# EAGLE design adns3050 v6 (EAGLE 6.6.0)
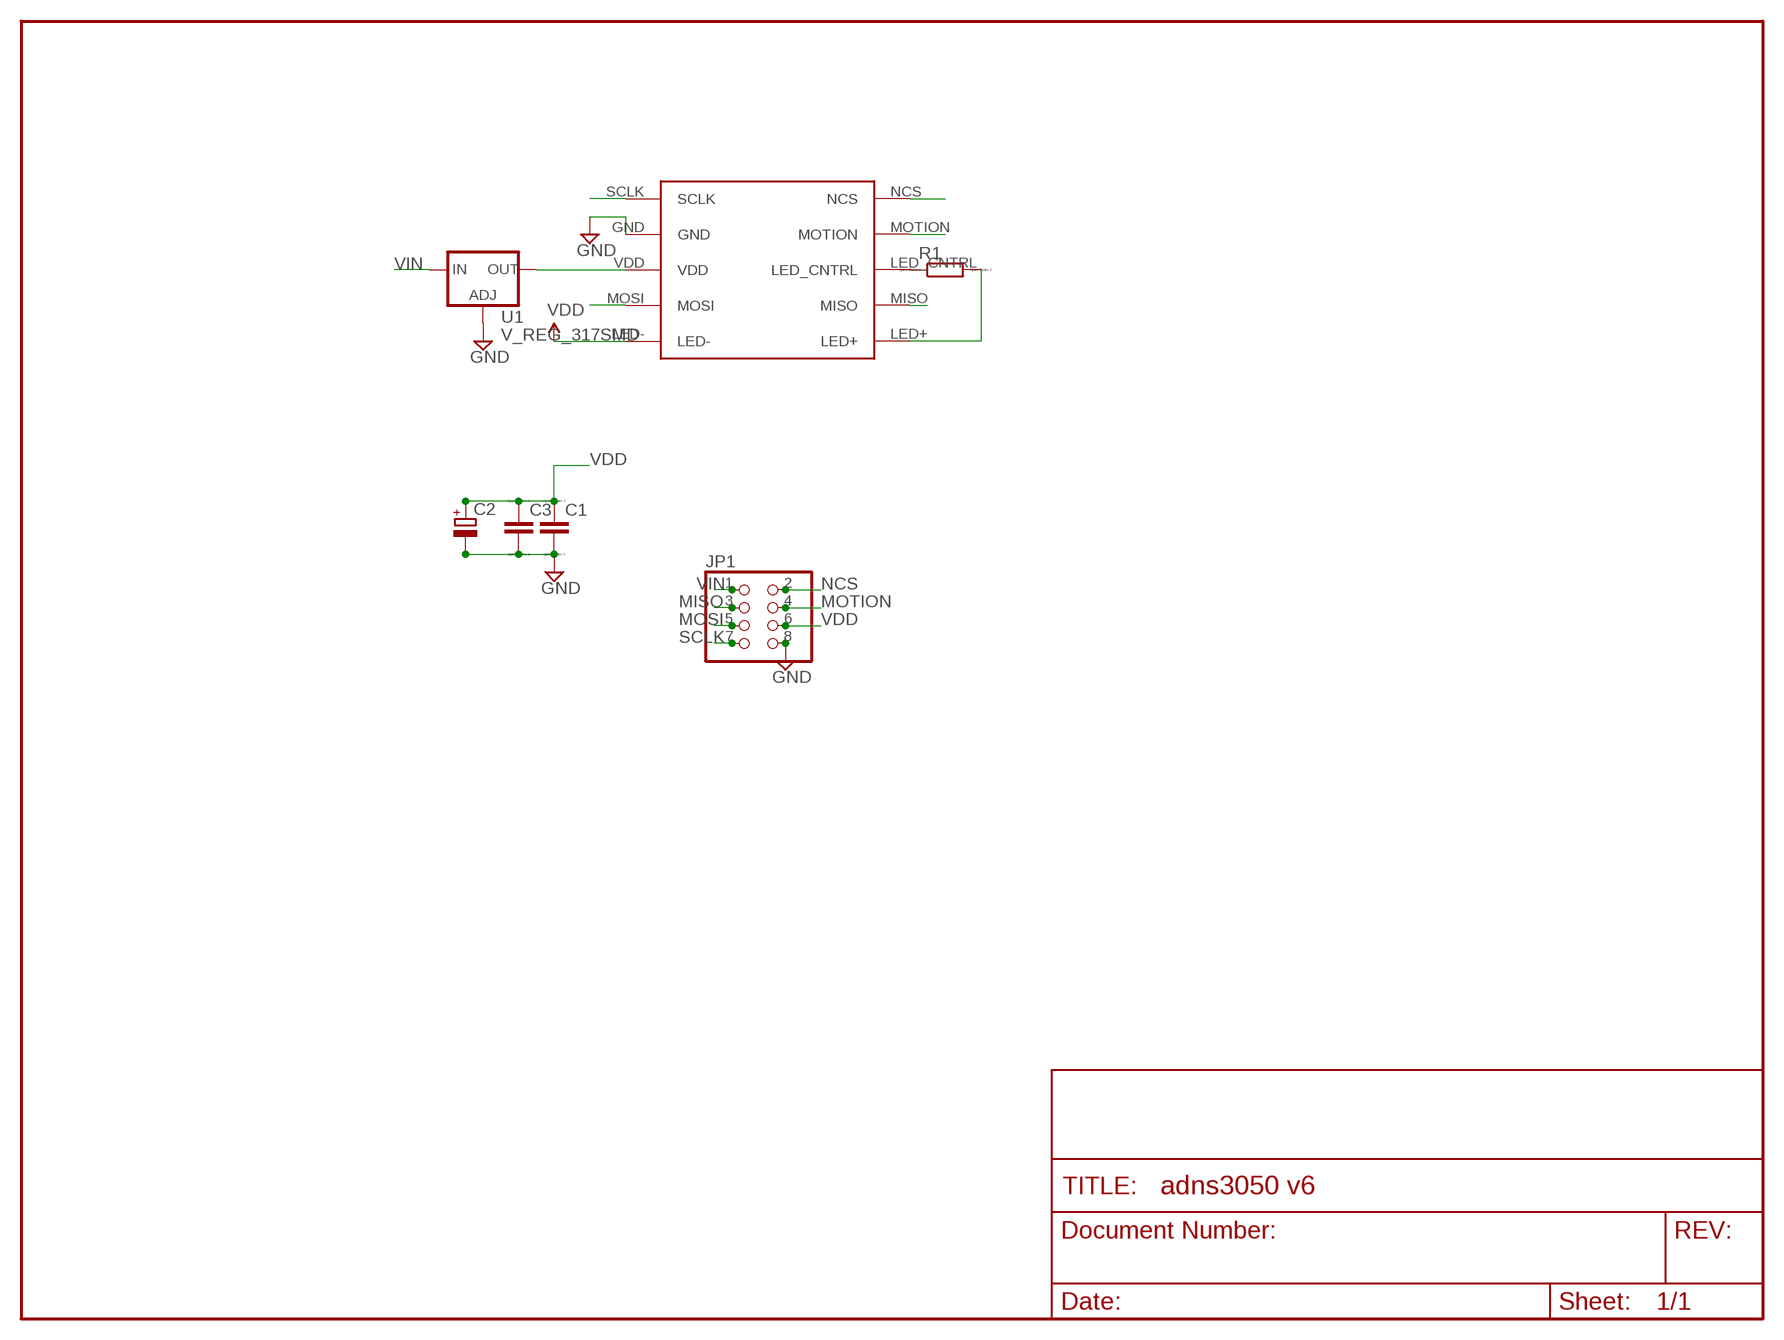
[diagram p0: schematic, sheet 1]

## Parts
C1  CC0603  [C0603]
C2  CPOL-EUR/2012-12R  [R/2012-12R]
C3  CC0603  [C0603]
JP1  PINHD-2X4  [2X04]
R1  RR0603  [R0603]
U1  V_REG_317SMD  [SOT223]
U$1  3050  [ADNS3]

## Nets
GND: C1.2 C2.- C3.2 JP1.8 U1.1(ADJ) U$1.GND
MISO: JP1.3 U$1.MISO
MOSI: JP1.5 U$1.MOSI
MOTION: JP1.4 U$1.MOTION
N$1: R1.1 U$1.LED_CNTRL
N$3: R1.2 U$1.LED+
NCS: JP1.2 U$1.NCS
SCLK: JP1.7 U$1.SCLK
VDD: C1.1 C2.+ C3.1 JP1.6 U1.2(OUT) U$1.LED- U$1.VDD
VIN: JP1.1 U1.3(IN)

## Library data of the parts
C1 C3 = eagle-ltspice:C: CAPACITOR, European symbol; SPICEMODEL: NONE; SPICEPREFIX: C
C2 = rcl:CPOL-EU: POLARIZED CAPACITOR, European symbol
JP1 = pinhead:PINHD-2X4: PIN HEADER
R1 = eagle-ltspice:R: RESISTOR, European symbol; SPICEMODEL: NONE; SPICEPREFIX: R
U1 = SparkFun-PowerIC:V_REG_317: Voltage Regulator Standard LM317 adjustable voltage regulator. AOI (Adjust Output Input). Google 'LM317 Calculator' for easy to use app to get the two resistor values needed. 240/720 for 5V output. 240/390 for 3.3V output. Spark Fun Electronics SKU : COM-00527
U$1 = ADNS3050:3050

## Board
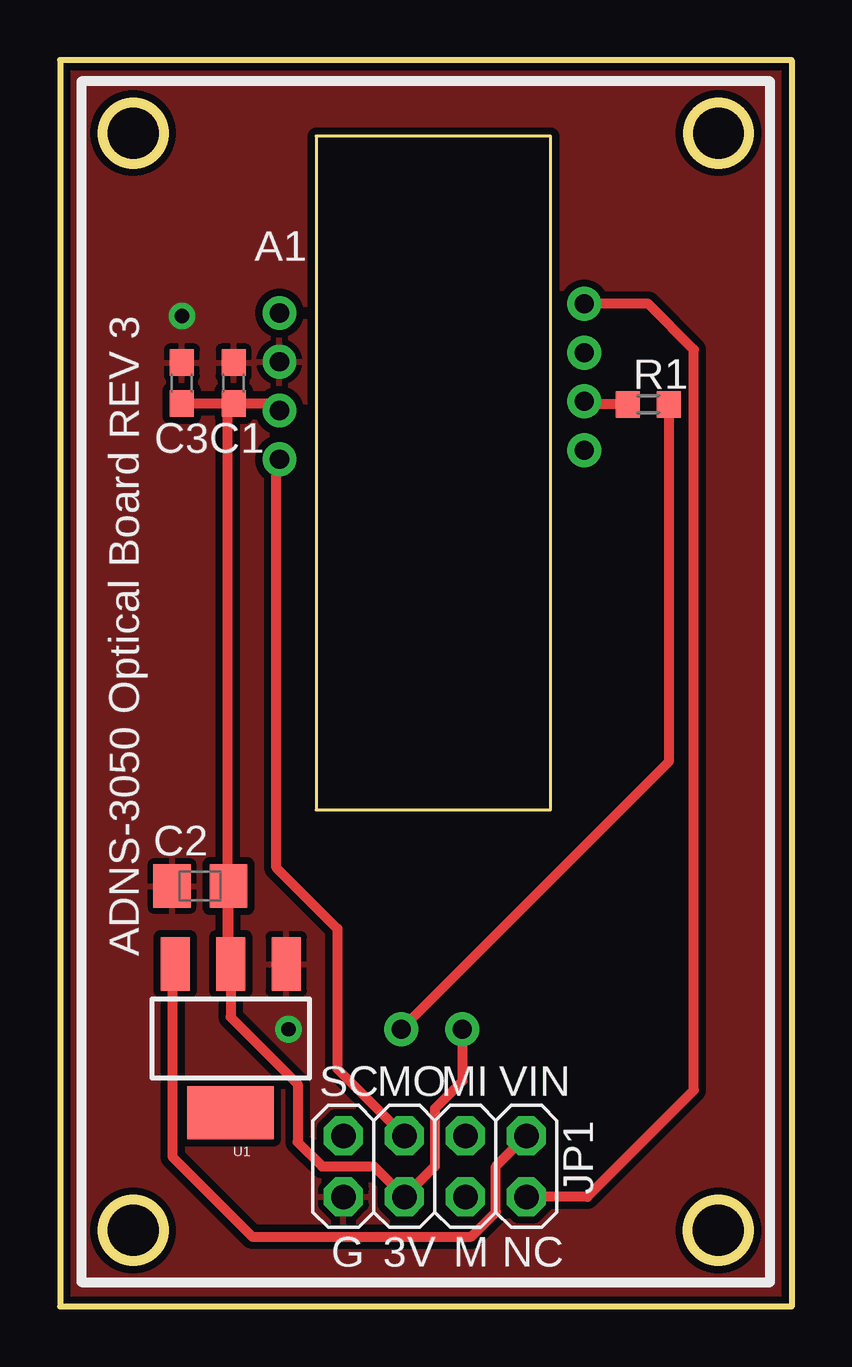
[diagram p1: board, top side]
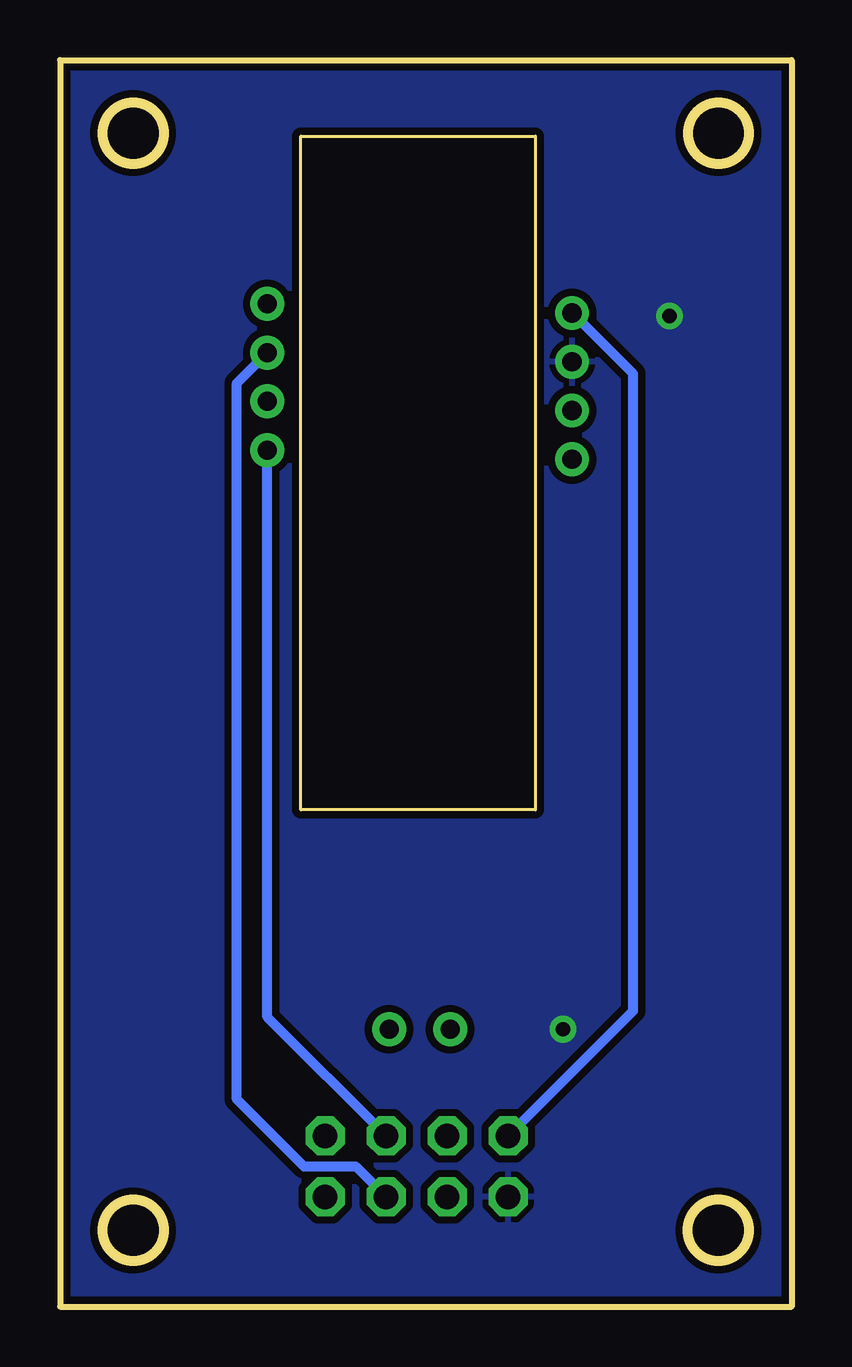
[diagram p2: board, bottom side, seen from below]

Size 30.48 x 51.94 mm. Coordinates in mm from the lower left corner, seen from the top.
Outline: 30.48,51.94 30.48,0 0,0 0,51.94 30.48,51.94
Outline: circle at 3.05,48.9 radius 1.27
Outline: circle at 27.43,48.9 radius 1.27
Outline: circle at 3.05,3.17 radius 1.28
Outline: circle at 27.43,3.17 radius 1.28
Copper layers (1*16): Top 0.035mm / dielectric 1.5mm / Bottom 0.035mm
Design rules "SparkFun *": minimum track width 8mil, minimum drill 20mil, track to track 8mil, track to pad 8mil, pad to pad 8mil, via to via 8mil, smd to smd 8mil, copper to edge 8mil, drill to drill 8mil, minimum pad ring 12mil, minimum via ring 10mil, stop-mask expansion 4mil, vias tented up to drill 25mil, thermal gap 10mil

### Footprints (pad centres in the part's own frame; a part is rotated, then mirrored left to right if it is on the bottom)
C0603 = smd 1.1 x 1: 1 -0.85,0; 2 0.85,0
R/2012-12R = smd 1.55 x 1.8: + 1.175,0; - -1.175,0
2X04 = drill 1.016 octagon: 1 -3.81,-1.27; 2 -3.81,1.27; 3 -1.27,-1.27; 4 -1.27,1.27; 5 1.27,-1.27; 6 1.27,1.27; 7 3.81,-1.27; 8 3.81,1.27
R0603 = smd 1 x 1.1: 1 -0.85,0; 2 0.85,0
SOT223 = smd 1.219 x 2.235: 1 -2.311,-3.099; 2 0,-3.099; 3 2.311,-3.099 | smd 3.6 x 2.2: 4 0,3.099
ADNS3 = drill 0.8: GND -6.35,3.683; LED+ -1.27,-24.13; LED- 1.27,-24.13; LED_CNTRL 6.35,2.032; MISO 6.35,0; MOSI -6.35,-0.381; MOTION 6.35,4.064; NCS 6.35,6.096; SCLK -6.35,5.715; VDD -6.35,1.651

### Placement (x,y rotation side)
C1  7.24,38.48 90 top
C2  5.84,17.53 0 top
C3  5.08,38.48 90 top
JP1  15.62,5.84 180 top
R1  24.51,37.59 0 top
U1  7.11,11.18 180 top
U$1  15.49,35.69 0 top

### Tracks (layer width: path | path; a pad name or v marks a point on that pad's centre or on a via)
GND  (via drill 0.6, 0.6 pad 0.81)
  other vias: 9.53,11.56 5.08,41.28
  pour Bottom (isolate 0.305): 0,0 0,51.94 30.48,51.94 30.48,0
  pour Top (isolate 0.305): 0,0 0,51.94 30.48,51.94 30.48,0
MISO
  Bottom 0.406: U$1.MISO 21.84,12.06 JP1.3
MOSI
  Top 0.406: U$1.MOSI 9.02,35.18 9.02,18.29 11.56,15.75 11.56,9.91 JP1.5
MOTION
  Bottom 0.406: U$1.MOTION 23.11,38.48 23.11,8.64 20.32,5.84 18.16,5.84 JP1.4
N$1
  Top 0.406: R1.1 21.97,37.59 U$1.LED_CNTRL
N$3
  Top 0.406: R1.2 25.36,22.69 U$1.LED+
NCS
  Top 0.406: U$1.NCS 24.51,41.78 26.42,39.88 26.42,9.02 21.97,4.57 JP1.2
SCLK
  Bottom 0.406: U$1.SCLK 6.6,38.86 6.6,12.32 JP1.7
VDD
  Top 0.406: C1.1 8.85,37.63 U$1.VDD | 7.11,37.5 C1.1 | U1.2 7.11,12.06 9.91,9.27 9.91,6.86 10.92,5.84 13.08,5.84 JP1.6 15.62,5.84 15.62,8.25 16.76,9.4 U$1.LED- | C3.1 C1.1 | U1.2 6.98,14.27 6.98,37.38 C1.1 | C2.+ 7.02,14.37 U1.2
VIN
  Top 0.406: U1.3 4.7,14.17 4.7,6.22 8,2.92 17.14,2.92 18.16,3.94 18.16,5.84 JP1.1

### Text on the board
tPlace: A1 | ADNS-3050 Optical Board REV 3 | SC | MO | MI | VIN | G | 3V | M | NC